# EAGLE design D2R (EAGLE 6.5.0)
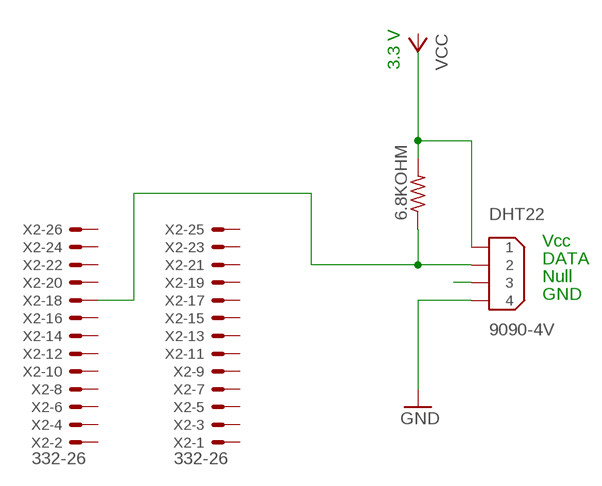
[diagram p0: schematic, sheet 1]

## Parts
6.8KOHM  R-US_0207/10  [0207/10]
DHT22  9090-4V  [9090-4V]
X2  332-26  [332-26]

## Nets
GND: DHT22.4
N$1: 6.8KOHM.2 DHT22.1
N$3: 6.8KOHM.1 DHT22.2 X2.18
N$4: DHT22.3
Unconnected: X2.1 X2.2 X2.3 X2.4 X2.5 X2.6 X2.7 X2.8 X2.9 X2.10 X2.11 X2.12 X2.13 X2.14 X2.15 X2.16 X2.17 X2.19 X2.20 X2.21 X2.22 X2.23 X2.24 X2.25 X2.26

## Notes on the sheet
- 3.3 V
- Vcc
- DATA
- Null
- GND

## Library data of the parts
6.8KOHM = resistor:R-US_: RESISTOR, American symbol
DHT22 = con-thomas-betts:9090-4: Disk Drive Power four position Source: Thomas & Betts Electronic Interconnects Eiropean Edition 1998; OC_FARNELL: unknown; OC_NEWARK: unknown
X2 = con-garry:332-26: 26 Pin - 2mm Dual Row Source: www.mpe-connector.de / garry_shortform_2012.pdf

## Board
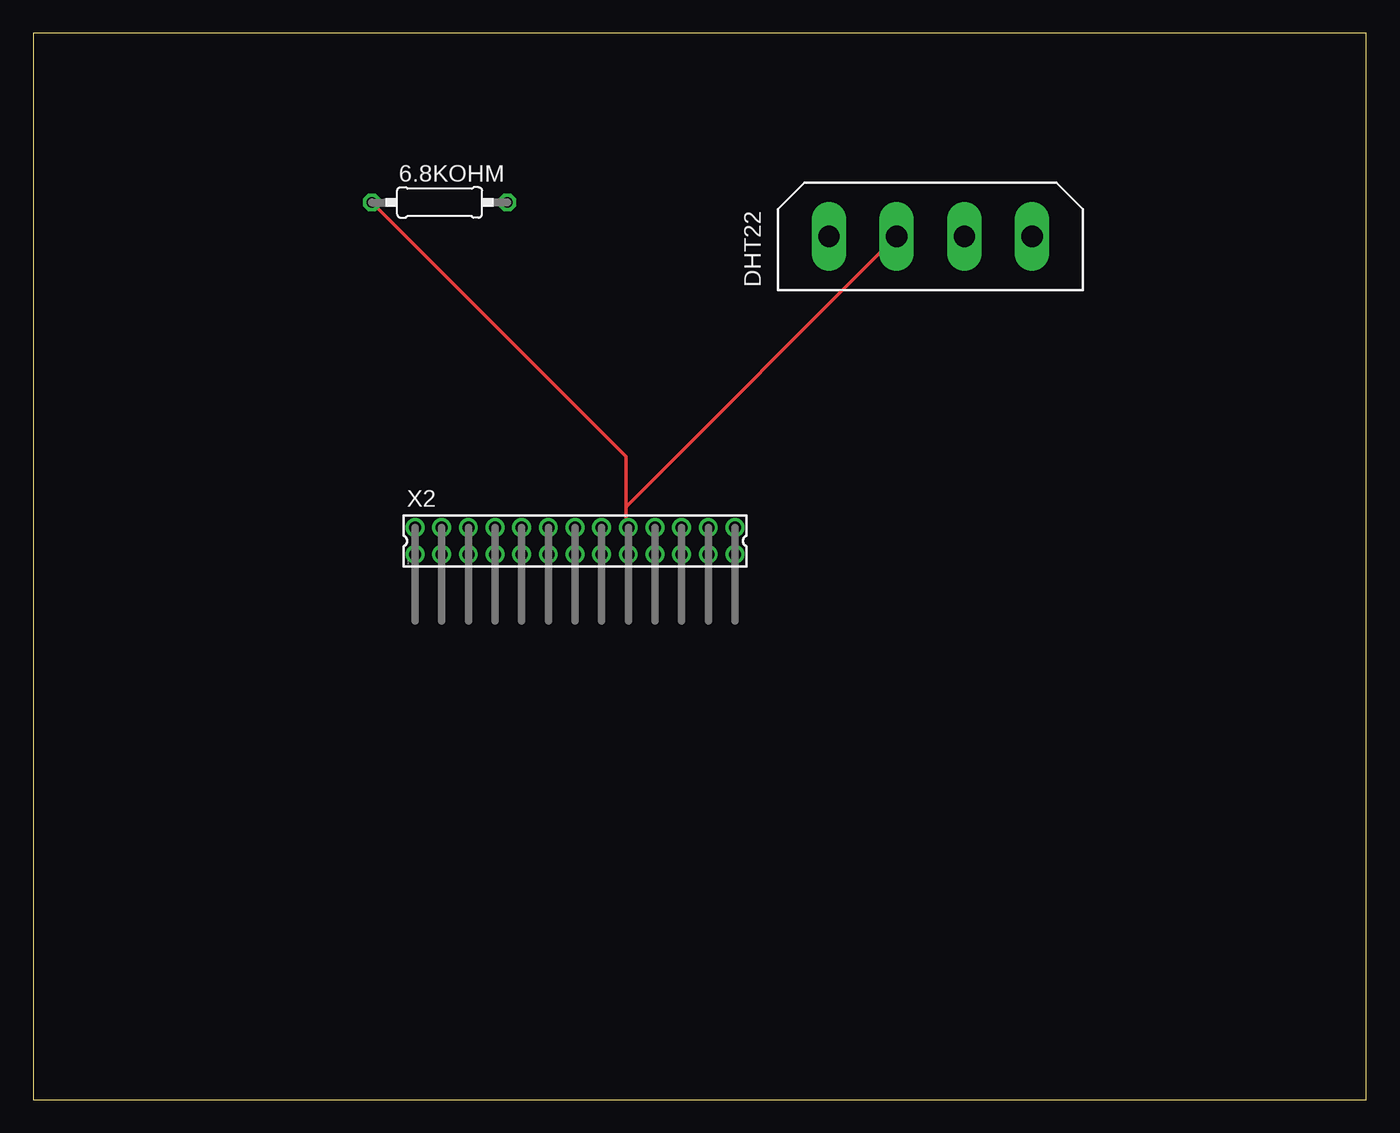
[diagram p1: board, top side]
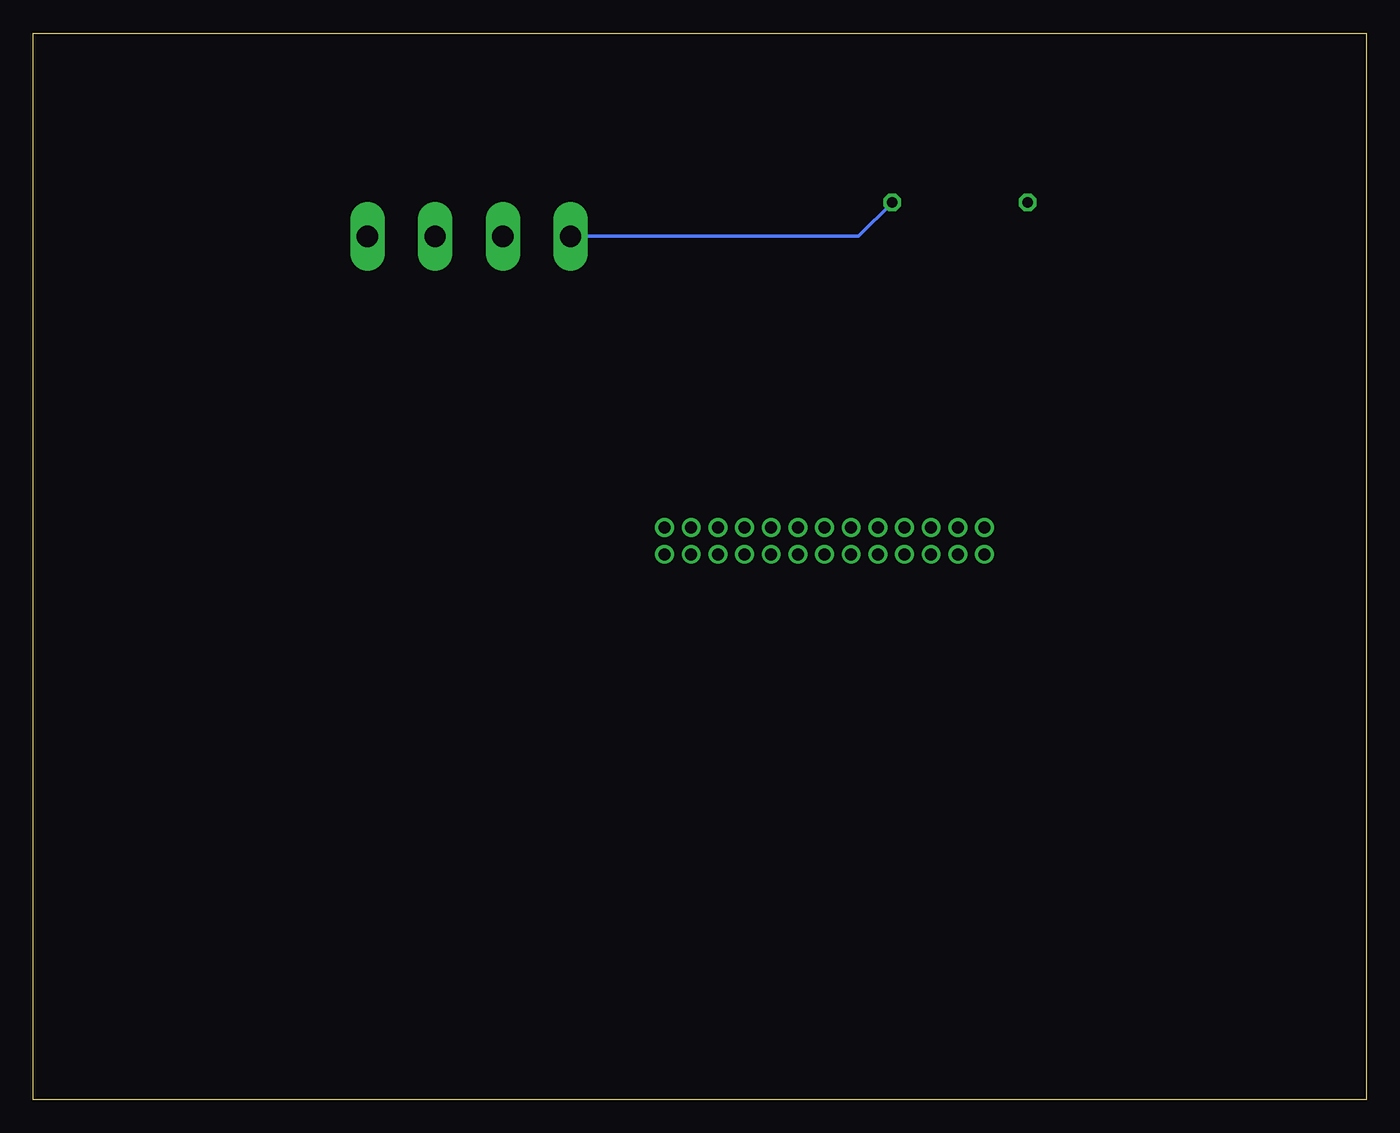
[diagram p2: board, bottom side, seen from below]

Size 100 x 80 mm. Coordinates in mm from the lower left corner, seen from the top.
Outline: 0,0 100,0 100,80 0,80 0,0
Copper layers (1*16): Top 0.035mm / dielectric 1.5mm / Bottom 0.035mm
Design rules "default": minimum track width 10mil, minimum drill 24mil, track to track 8mil, track to pad 8mil, pad to pad 8mil, via to via 8mil, smd to smd 8mil, copper to edge 40mil, drill to drill 8mil, minimum pad ring 10mil, minimum via ring 8mil, stop-mask expansion 4mil, vias tented up to drill 0mil, thermal gap 10mil

### Footprints (pad centres in the part's own frame; a part is rotated, then mirrored left to right if it is on the bottom)
0207/10 = drill 0.813 octagon: 1 -5.08,0; 2 5.08,0
9090-4V = drill 1.6 pad 2.6 long: 1 -7.62,0; 2 -2.54,0; 3 2.54,0; 4 7.62,0
332-26 = drill 0.9 pad 1.27: 1 -12,-1; 2 -12,1; 3 -10,-1; 4 -10,1; 5 -8,-1; 6 -8,1; 7 -6,-1; 8 -6,1; 9 -4,-1; 10 -4,1; 11 -2,-1; 12 -2,1; 13 0,-1; 14 0,1; 15 2,-1; 16 2,1; 17 4,-1; 18 4,1; 19 6,-1; 20 6,1; 21 8,-1; 22 8,1; 23 10,-1; 24 10,1; 25 12,-1; 26 12,1

### Placement (x,y rotation side)
6.8KOHM  30.48,67.31 0 top
DHT22  67.31,64.77 0 top
X2  40.64,41.91 0 top

### Tracks (layer width: path | path; a pad name or v marks a point on that pad's centre or on a via)
N$1
  Bottom 0.254: 6.8KOHM.2 38.1,64.77 DHT22.1
N$3
  Top 0.254: 6.8KOHM.1 44.45,48.26 44.45,44.45 | 44.45,44.45 44.45,43.18 X2.18 | 44.45,44.45 DHT22.2